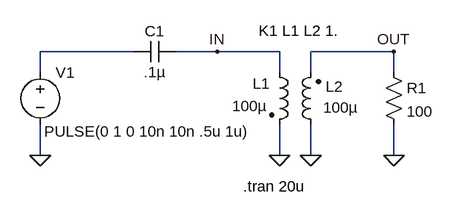
[diagram p0: schematic xformer.asc]
xformer.asc, the LTspice schematic file:
Version 4
SHEET 1 880 680
WIRE -336 224 -336 192
WIRE -336 352 -336 304
WIRE -192 192 -336 192
WIRE -64 192 -128 192
WIRE 32 192 -64 192
WIRE 32 224 32 192
WIRE 32 352 32 304
WIRE 80 224 80 192
WIRE 80 352 80 304
WIRE 208 192 80 192
WIRE 208 224 208 192
WIRE 208 352 208 304
FLAG 32 352 0
FLAG -336 352 0
FLAG 80 352 0
FLAG 208 352 0
FLAG 208 192 OUT
FLAG -64 192 IN
SYMBOL ind2 16 208 R0
WINDOW 0 2 33 Right 0
WINDOW 3 -3 68 Right 0
SYMATTR InstName L1
SYMATTR Value 100µ
SYMATTR Type ind
SYMBOL ind2 96 320 R180
WINDOW 0 -7 74 Right 0
WINDOW 3 -3 42 Right 0
SYMATTR InstName L2
SYMATTR Value 100µ
SYMATTR Type ind
SYMBOL voltage -336 208 R0
WINDOW 3 6 107 Left 0
SYMATTR Value PULSE(0 1 0 10n 10n .5u 1u)
SYMATTR InstName V1
SYMBOL res 192 208 R0
SYMATTR InstName R1
SYMATTR Value 100
SYMBOL cap -128 176 R90
WINDOW 0 0 32 VBottom 0
WINDOW 3 32 32 VTop 0
SYMATTR InstName C1
SYMATTR Value .1µ
TEXT -24 400 Left 0 !.tran 20u
TEXT 0 160 Left 0 !K1 L1 L2 1.

The netlist it stands for:
* xformer.asc
L1 IN 0 100µ
L2 0 OUT 100µ
V1 N001 0 PULSE(0 1 0 10n 10n .5u 1u)
R1 OUT 0 100
C1 IN N001 .1µ
.tran 20u
K1 L1 L2 1.
.backanno
.end